# EAGLE design PCB (EAGLE 9.5.2)
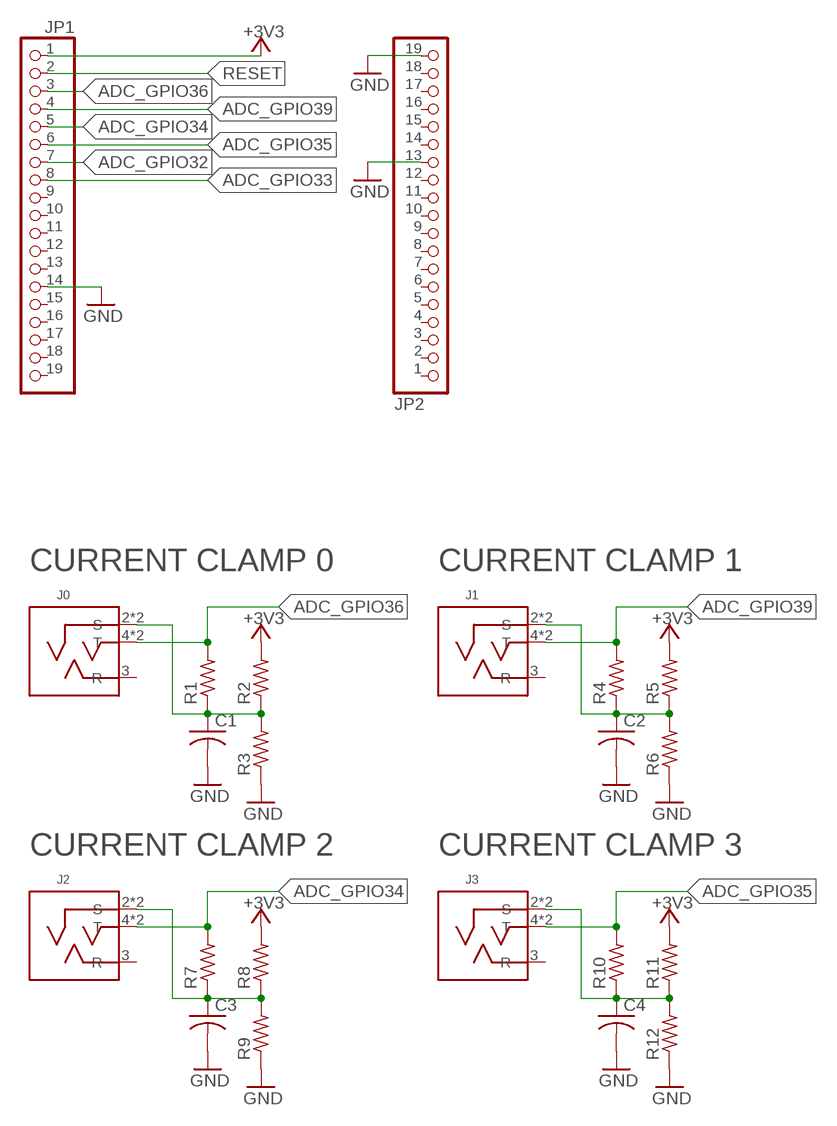
[diagram p0: schematic, sheet 1]

## Parts
C1  C-USC1206  [C1206]
C2  C-USC1206  [C1206]
C3  C-USC1206  [C1206]
C4  C-USC1206  [C1206]
J0  BOOMELE_C18167  [PJ-313]
J1  BOOMELE_C18167  [PJ-313]
J2  BOOMELE_C18167  [PJ-313]
J3  BOOMELE_C18167  [PJ-313]
JP1  PINHD-1X19  [1X19]
JP2  PINHD-1X19  [1X19]
R1  R-US_R1206  [R1206]
R2  R-US_R1206  [R1206]
R3  R-US_R1206  [R1206]
R4  R-US_R1206  [R1206]
R5  R-US_R1206  [R1206]
R6  R-US_R1206  [R1206]
R7  R-US_R1206  [R1206]
R8  R-US_R1206  [R1206]
R9  R-US_R1206  [R1206]
R10  R-US_R1206  [R1206]
R11  R-US_R1206  [R1206]
R12  R-US_R1206  [R1206]

## Nets
+3V3: JP1.1 R2.2 R5.2 R8.2 R11.2
ADC_GPIO32: JP1.7
ADC_GPIO33: JP1.8
ADC_GPIO34: J2.4(T) J2.4.(T) JP1.5 R7.2
ADC_GPIO35: J3.4(T) J3.4.(T) JP1.6 R10.2
ADC_GPIO36: J0.4(T) J0.4.(T) JP1.3 R1.2
ADC_GPIO39: J1.4(T) J1.4.(T) JP1.4 R4.2
GND: C1.2 C2.2 C3.2 C4.2 JP1.14 JP2.13 JP2.19 R3.1 R6.1 R9.1 R12.1
N$1: C2.1 J1.2(S) J1.2.(S) R4.1 R5.1 R6.2
N$2: C1.1 J0.2(S) J0.2.(S) R1.1 R2.1 R3.2
N$5: C3.1 J2.2(S) J2.2.(S) R7.1 R8.1 R9.2
N$7: C4.1 J3.2(S) J3.2.(S) R10.1 R11.1 R12.2
RESET: JP1.2
Unconnected: J0.3(R) J1.3(R) J2.3(R) J3.3(R) JP1.9 JP1.10 JP1.11 JP1.12 JP1.13 JP1.15 JP1.16 JP1.17 JP1.18 JP1.19 JP2.1 JP2.2 JP2.3 JP2.4 JP2.5 JP2.6 JP2.7 JP2.8 JP2.9 JP2.10 JP2.11 JP2.12 JP2.14 JP2.15 JP2.16 JP2.17 JP2.18

## Notes on the sheet
- CURRENT CLAMP 0 | CURRENT CLAMP 1
- CURRENT CLAMP 2 | CURRENT CLAMP 3

## Library data of the parts
C1-C4 = rcl:C-US: CAPACITOR, American symbol; SPICEPREFIX: C
J0 J1-J3 = custom parts:BOOMELE_C18167
JP1 JP2 = pinhead:PINHD-1X19: PIN HEADER
R1-R12 = rcl:R-US_: RESISTOR, American symbol; SPICEPREFIX: R

## Board
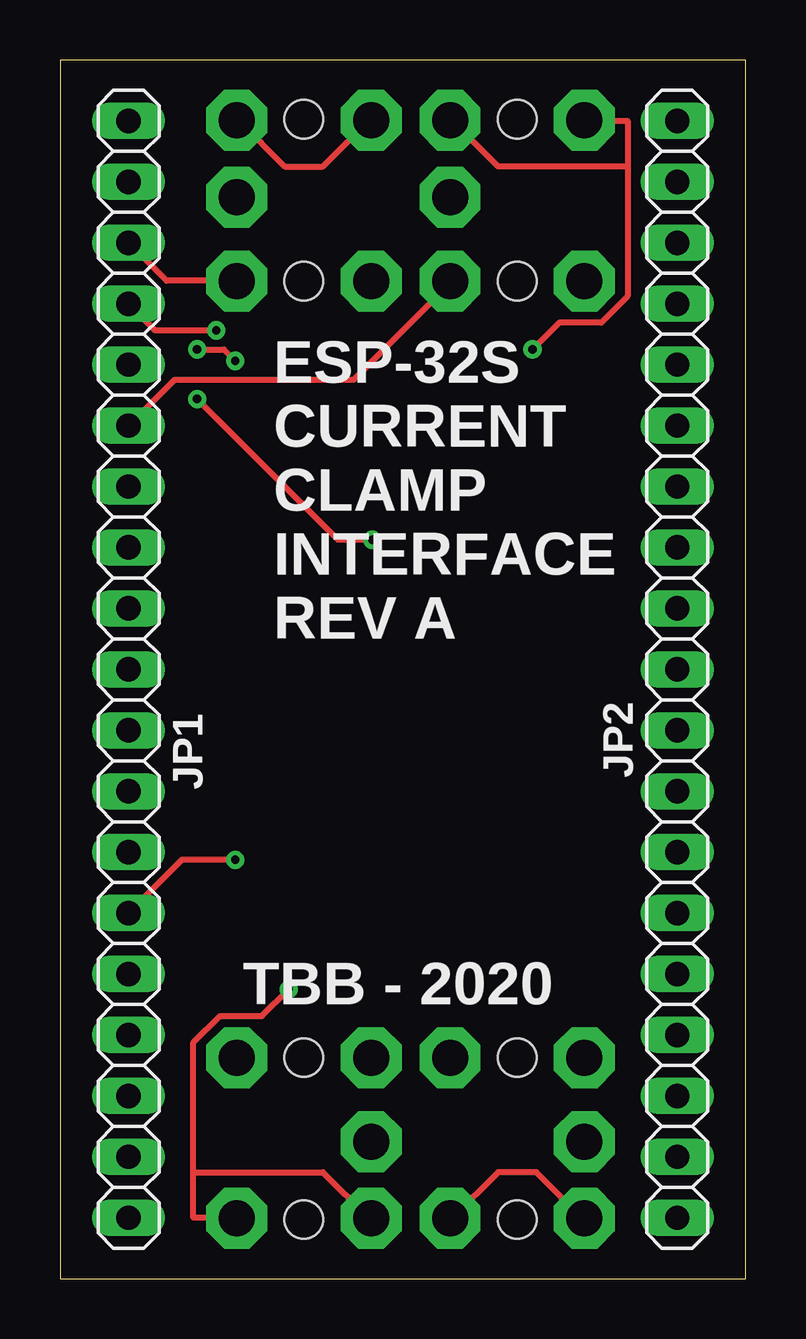
[diagram p1: board, top side]
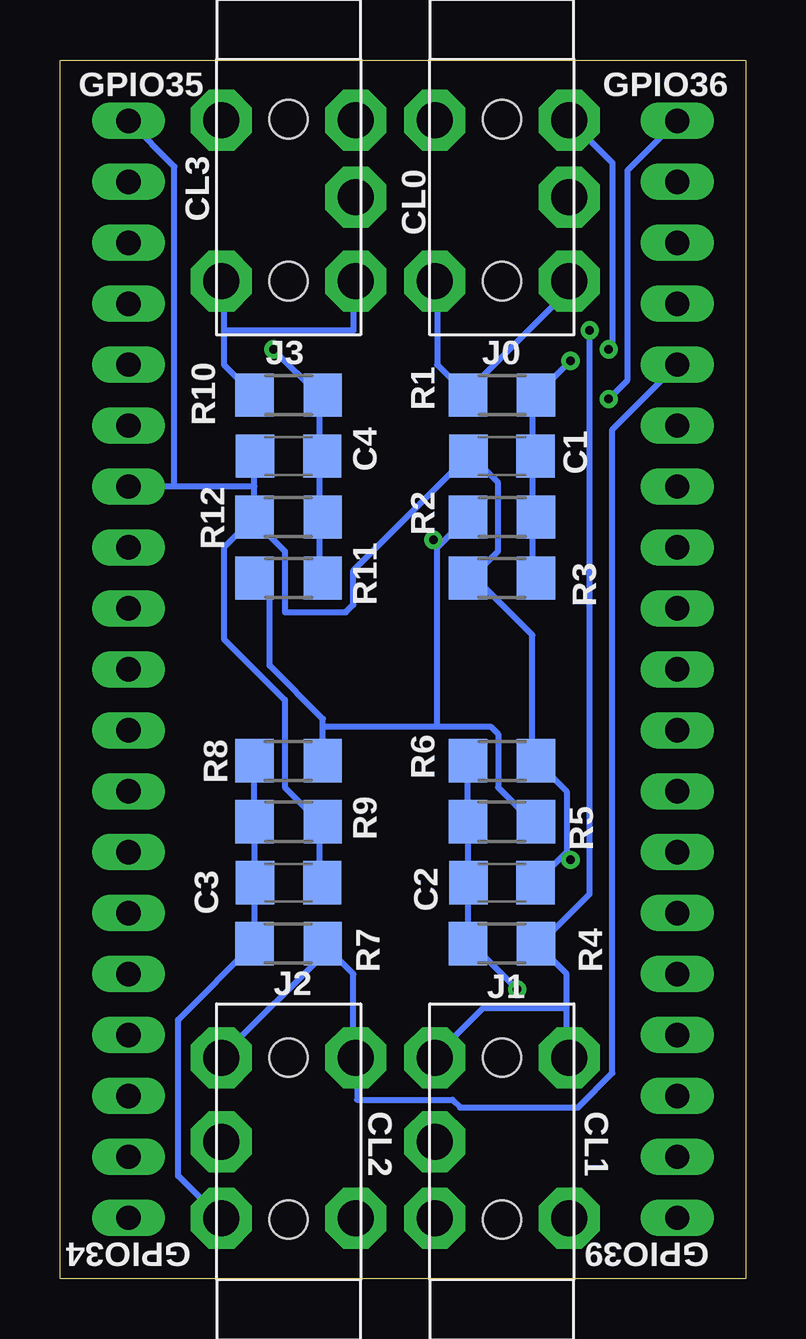
[diagram p2: board, bottom side, seen from below]

Size 28.57 x 50.8 mm. Coordinates in mm from the lower left corner, seen from the top.
Outline: 0,0 28.57,0 28.57,50.8 0,50.8 0,0
Copper layers (1*16): Top 0.035mm / dielectric 1.5mm / Bottom 0.035mm
Design rules "default *": minimum track width 10mil, minimum drill 0.35mm, track to track 10mil, track to pad 10mil, pad to pad 10mil, via to via 10mil, smd to smd 6mil, copper to edge 40mil, drill to drill 6mil, minimum pad ring 10mil, minimum via ring 8mil, stop-mask expansion 4mil, vias tented up to drill 20mil, thermal gap 10mil

### Footprints (pad centres in the part's own frame; a part is rotated, then mirrored left to right if it is on the bottom)
C1206 = smd 1.6 x 1.8: 1 -1.4,0; 2 1.4,0
PJ-313 = drill 1.5 pad 2.54 octagon: 2 -3.2,2.8; 2. -3.2,-2.8; 3 0,2.8; 4 3.5,2.8; 4. 3.5,-2.8 | hole 1.6: 3.5,0; -3.25,0
1X19 = drill 1.016 long: 1 -22.86,0; 2 -20.32,0; 3 -17.78,0; 4 -15.24,0; 5 -12.7,0; 6 -10.16,0; 7 -7.62,0; 8 -5.08,0; 9 -2.54,0; 10 0,0; 11 2.54,0; 12 5.08,0; 13 7.62,0; 14 10.16,0; 15 12.7,0; 16 15.24,0; 17 17.78,0; 18 20.32,0; 19 22.86,0
R1206 = smd 1.6 x 1.803: 1 -1.422,0; 2 1.422,0

### Placement (x,y rotation side)
C1  10.16,34.29 180 bottom
C2  10.16,16.51 0 bottom
C3  19.05,16.51 0 bottom
C4  19.05,34.29 180 bottom
J0  10.16,45.09 270 bottom
J1  10.16,5.71 90 bottom
J2  19.05,5.71 90 bottom
J3  19.05,45.09 270 bottom
JP1  2.86,25.4 270 top
JP2  25.72,25.4 90 top
R1  10.16,36.83 180 bottom
R2  10.16,31.75 180 bottom
R3  10.16,29.21 0 bottom
R4  10.16,13.97 0 bottom
R5  10.16,19.05 0 bottom
R6  10.16,21.59 180 bottom
R7  19.05,13.97 0 bottom
R8  19.05,21.59 0 bottom
R9  19.05,19.05 180 bottom
R10  19.05,36.83 180 bottom
R11  19.05,29.21 180 bottom
R12  19.05,31.75 0 bottom

### Tracks (layer width: path | path; a pad name or v marks a point on that pad's centre or on a via)
+3V3  (via drill 0.35)
  Top 0.254: v5.71,36.67 11.59,30.8 v13.02,30.8
  Bottom 0.254: 17.62,23.02 12.86,23.02 | 12.86,23.02 10.64,23.02 10.32,22.7 10.32,20.48 8.89,19.05 R5.2 | 17.62,23.02 R8.2 | 12.78,30.56 12.86,30.48 12.86,23.02 | 12.78,30.56 R2.2 | 17.62,23.02 17.62,23.34 19.84,25.56 19.84,28.73 20.32,29.21 R11.2 | JP1.1 4.92,46.2 4.92,37.47 v5.71,36.67 | 12.78,30.56 v13.02,30.8
ADC_GPIO34
  Bottom 0.254: JP1.5 5.56,35.4 5.56,8.57 6.98,7.14 11.91,7.14 12.22,7.46 16.19,7.46 16.19,9.21 J2.4. 16.35,9.37 16.35,12.7 R7.2 17.46,13.65 21.75,9.37 J2.4
ADC_GPIO35
  Top 0.254: JP1.6 4.76,37.47 12.22,37.47 16.19,41.43 J3.4
  Bottom 0.254: 21.75,39.53 21.75,41.43 J3.4. | 21.75,39.53 21.75,38.1 R10.2 | 21.75,39.53 16.35,39.53 16.35,41.43 J3.4
ADC_GPIO36
  Top 0.254: JP1.3 4.45,41.59 7.3,41.59 J0.4
  Bottom 0.254: J0.4. 12.86,41.43 12.86,38.1 R1.2 11.59,36.99 7.46,41.12 7.46,41.43 J0.4
ADC_GPIO39  (via drill 0.35)
  Top 0.254: JP1.4 3.97,39.53 v6.51,39.53
  Bottom 0.254: 7.46,11.27 7.46,9.37 J1.4. | 7.46,11.27 7.46,12.7 R4.2 8.57,13.97 6.51,16.03 v6.51,39.53 | 7.46,11.27 10.95,11.27 12.86,9.37 J1.4
GND  (via drill 0.35)
  Top 0.254: JP1.14 5.08,17.46 v7.3,17.46
  Bottom 0.254: 7.54,17.7 7.46,17.78 7.46,20.32 R6.1 8.89,21.59 8.89,26.83 11.27,29.21 R3.1 11.43,29.21 10.32,30.32 10.32,33.18 11.43,34.29 C1.2 11.59,34.29 16.35,29.53 16.35,28.1 16.67,27.78 19.21,27.78 19.21,30.32 20.48,31.59 R12.1 | 7.54,17.7 8.73,16.51 C2.2 | 7.54,17.7 v7.3,17.46 | 17.78,19.05 17.78,16.51 C3.2 | R12.1 20.48,33.02 | 20.48,33.02 20.48,34.29 C4.2 | 17.78,19.05 19.21,20.48 19.21,24.13 21.75,26.67 21.75,30.48 R12.1 | 17.78,19.05 R9.1 | 20.48,33.02 23.81,33.02 | 23.81,33.02 JP2.13 | JP2.19 23.81,46.36 23.81,33.02
N$1  (via drill 0.35)
  Top 0.254: v9.53,12.06 8.41,10.95 6.67,10.95 5.56,9.84 5.56,4.45 | 5.56,4.45 5.56,2.54 7.3,2.54 J1.2. | 5.56,4.45 10.95,4.45 12.86,2.54 J1.2
  Bottom 0.254: R5.1 11.59,16.51 | 11.59,16.51 R4.1 11.43,13.97 v9.53,12.06 | 11.59,16.51 C2.1 | R5.1 R6.2 | R5.1
N$2  (via drill 0.35)
  Top 0.254: v7.3,38.26 6.83,38.74 v5.71,38.74 | J0.2. 12.86,48.26 10.95,46.36 9.37,46.36 7.46,48.26 J0.2
  Bottom 0.254: 8.89,31.75 8.89,29.21 R3.2 | 8.89,34.29 8.89,36.83 R1.1 v7.3,38.26 | 8.89,34.29 8.89,31.75 | 8.89,31.75 R2.1 | 8.89,34.29 C1.1 | v5.71,38.74 5.56,38.89 5.56,46.51 7.3,48.26 J0.2
N$5
  Top 0.254: J2.2. 16.35,2.54 18.26,4.45 19.84,4.45 21.75,2.54 J2.2
  Bottom 0.254: R9.2 20.48,16.51 | 20.48,16.51 R7.1 | 20.48,16.51 C3.1 | R9.2 R8.1 | R9.2 | R7.1 23.65,10.79 23.65,4.29 21.91,2.54 J2.2 | R7.1
N$7  (via drill 0.35)
  Top 0.254: v19.68,38.74 20.8,39.85 22.54,39.85 23.65,40.96 23.65,46.36 | 23.65,46.36 23.65,48.26 21.91,48.26 J3.2. | 23.65,46.36 18.26,46.36 16.35,48.26 J3.2
  Bottom 0.254: 17.78,31.75 17.78,29.21 R11.1 | 17.78,36.83 17.78,34.29 | 17.78,34.29 17.78,31.75 | 17.78,31.75 R12.2 | 17.78,34.29 C4.1 | v19.68,38.74 17.78,36.83 | 17.78,36.83 R10.1

### Text on the board
tNames: ESP-32S / CURRENT / CLAMP / INTERFACE / REV A | TBB - 2020
bNames: GPIO36 | GPIO35 | CL0 | CL3 | CL1 | CL2 | GPIO39 | GPIO34